# Altium schematic sheet medusa-ai-audio.SchDoc
size Legal; SheetNumber: 2; SheetTotal: 5
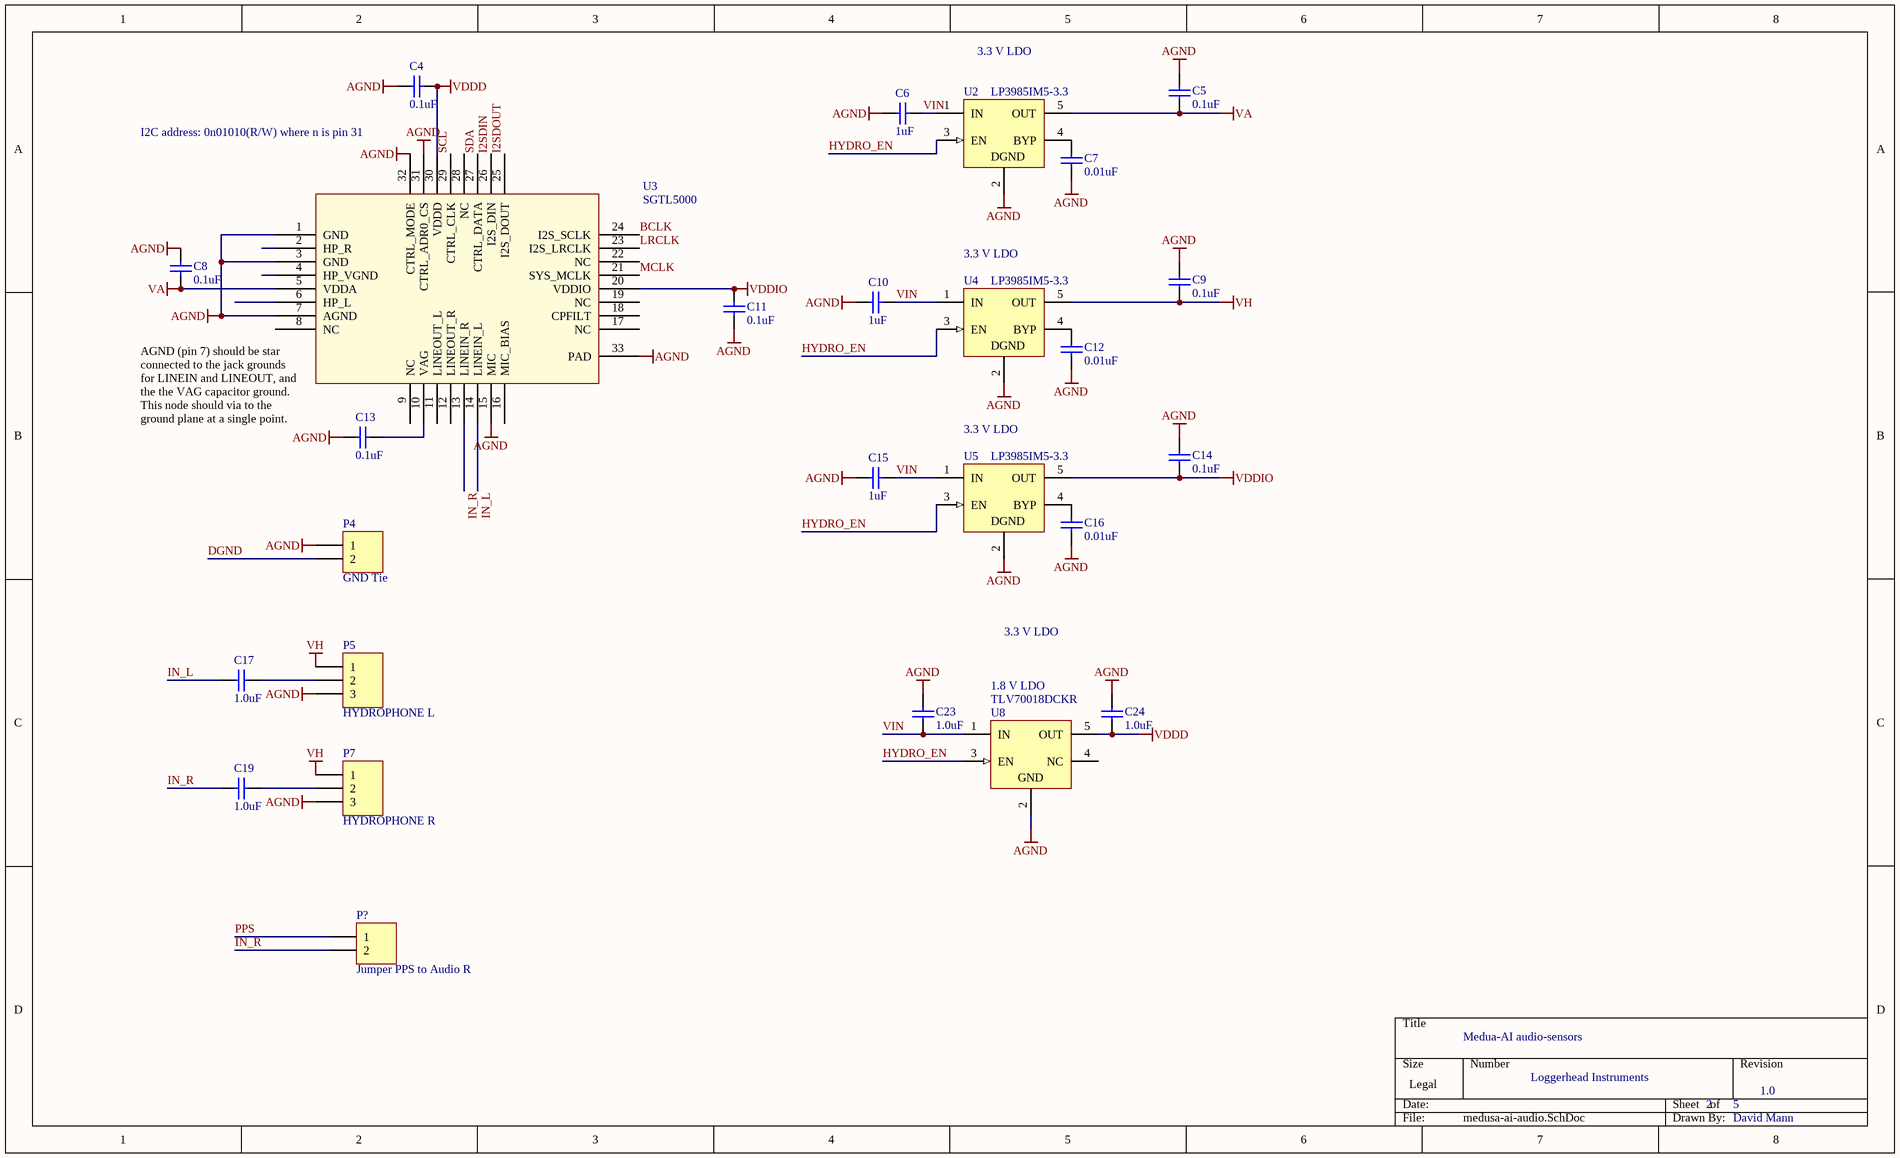
[diagram p0: medusa-ai-audio.SchDoc]

## Parts
C4  0.1uF  [0402]
C5  0.1uF  [0402]
C6  1uF  [0402]
C7  0.01uF  [0402]
C8  0.1uF  [0402]
C9  0.1uF  [0402]
C10  1uF  [0402]
C11  0.1uF  [0402]
C12  0.01uF  [0402]
C13  0.1uF  [0402]
C14  0.1uF  [0402]
C15  1uF  [0402]
C16  0.01uF  [0402]
C17  1.0uF  [0402]
C19  1.0uF  [0402]
C23  1.0uF  [0402]
C24  1.0uF  [0402]
P4  GND Tie  [HDR1X2]
P5  HYDROPHONE L  [HDR1X3]
P7  HYDROPHONE R  [HDR1X3]
P?  Jumper PPS to Audio R  [HDR1X2]
U2  LP3985IM5-3.3  [MF05A_N]
U3  SGTL5000  [QFN32]
U4  LP3985IM5-3.3  [MF05A_N]
U5  LP3985IM5-3.3  [MF05A_N]
U8  TLV70018DCKR  [TI-DCK5_V]

## Nets
AGND: C4.2 C5.2 C6.2 C7.2 C8.2 C9.2 C10.2 C11.2 C12.2 C13.2 C14.2 C15.2 C16.2 C23.2 C24.2 P4.1 P5.3 P7.3 U2.2(GND) U3.1(GND) U3.3(GND) U3.7(AGND) U3.15(MIC) U3.31(CTRL_ADR0_CS) U3.32(CTRL_MODE) U3.33(PAD) U4.2(GND) U5.2(GND) U8.2(GND)
VA: C5.1 C8.1 U2.5(OUT) U3.5(VDDA)
VDDD: C4.1 C24.1 U3.30(VDDD) U8.5(OUT)
VDDIO: C11.1 C14.1 U3.20(VDDIO) U5.5(OUT)
VH: C9.1 P5.1 P7.1 U4.5(OUT)
BCLK: U3.24(I2S_SCLK)
DGND: P4.2
HYDRO_EN: U2.3(EN) U4.3(EN) U5.3(EN) U8.3(EN)
I2SDIN: U3.26(I2S_DIN)
I2SDOUT: U3.25(I2S_DOUT)
IN_L: C17.2 U3.14(LINEIN_L)
IN_R: C19.2 P?.2 U3.13(LINEIN_R)
LRCLK: U3.23(I2S_LRCLK)
MCLK: U3.21(SYS_MCLK)
PPS: P?.1
SCL: U3.29(CTRL_CLK)
SDA: U3.27(CTRL_DATA)
VIN: C6.1 C10.1 C15.1 C23.1 U2.1(IN) U4.1(IN) U5.1(IN) U8.1(IN)
NetC7_1: C7.1 U2.4(BYP)
NetC12_1: C12.1 U4.4(BYP)
NetC13_1: C13.1 U3.10(VAG)
NetC16_1: C16.1 U5.4(BYP)
NetC17_1: C17.1 P5.2
NetC19_1: C19.1 P7.2

Not connected (* = marked no-connect by the designer): U3 2(HP_R) 4(HP_VGND) 6(HP_L) 8(NC) 9(NC) 11(LINEOUT_L) 12(LINEOUT_R) 16(MIC_BIAS) 17(NC) 18(CPFILT) 19(NC) 22(NC) 28(NC); U8 4(NC)

## Notes on the sheet
- 3.3 V LDO
- I2C address: 0n01010(R/W) where n is pin 31
- (near U4) 3.3 V LDO
- (near U3) AGND (pin 7) should be star connected to the jack grounds for LINEIN and LINEOUT, and the the VAG capacitor ground. This node should via to the ground plane at a single point.
- (near U5) 3.3 V LDO
- (near U8) 1.8 V LDO
- Medua-AI audio-sensors
- Loggerhead Instruments
- 2
- 5
- 1.0
- David Mann
- (in symbol LP3985IM5-3.3) DGND

## Library data of the parts
C4 C5 C8 C9 C11 C13 C14 = C0402: Ceramic Chip Capacitor - Standard; Note: Footprint corresponds to dimensions for bulk cassette packaging. This case size has tightened tolerances.; Published: 17-Jul-2002; LatestRevisionDate: 19-Mar-2004; LatestRevisionNote: Silkscreen size reduced.; DatasheetDocument: Mar-2001; PackageDocument: Mar-2001; PackageReference: 0402; Publisher: Altium Limited; Code_JEITA: 0402; Code_IPC: 1005 [0402]; ComponentLink1Description: Manufacturer Link; ComponentLink1URL: http://www.kemet.com/; ComponentLink2Description: Datasheet; ComponentLink2URL: http://www.kemet.com/kemet/web/homepage/kechome.nsf/vapubfilesname/F3102TA.pdf/$file/F3102TA.pdf; Value: 0.1uF
C6 C7 C10 C12 C15-C17 C19 C23 C24 = C0402: Ceramic Chip Capacitor - Standard; Note: Footprint corresponds to dimensions for bulk cassette packaging. This case size has tightened tolerances.; Value: 0.1uF; Published: 17-Jul-2002; LatestRevisionDate: 19-Mar-2004; LatestRevisionNote: Silkscreen size reduced.; DatasheetDocument: Mar-2001; PackageDocument: Mar-2001; PackageReference: 0402; Publisher: Altium Limited; Code_JEITA: 0402; Code_IPC: 1005 [0402]; ComponentLink1Description: Manufacturer Link; ComponentLink1URL: http://www.kemet.com/; ComponentLink2Description: Datasheet; ComponentLink2URL: http://www.kemet.com/kemet/web/homepage/kechome.nsf/vapubfilesname/F3102TA.pdf/$file/F3102TA.pdf
P4 P? = Header 2: Header, 2-Pin; LatestRevisionDate: 17-Jul-2002; LatestRevisionNote: Re-released for DXP Platform.; Publisher: Altium Limited
P5 P7 = Header 3: Header, 3-Pin; LatestRevisionDate: 17-Jul-2002; LatestRevisionNote: Re-released for DXP Platform.; Publisher: Altium Limited
U2 U4 U5 = LP3985IM5-3.3: Micropower, 150mA Low-Noise Ultra Low-Dropout CMOS Voltage Regulator; Manufacturer: National Semiconductor; CompType: LDO IC; PackageTopMarking: LDQB*XTT; PowerWise: N; Published: 4-Dec-2008; DatasheetVersion: Aug-2005; PackageVersion: revD, Aug-2008; PackageReference: MF05A; Publisher: Altium Limited; PackageDescription: Molded SOT-23, .115 x .063 x .040 in Body, 5 Lead, .0375 in Pitch; PartNumber: LP3985IM5-3.3; RoHS: O; PinCount: 5; DigiKeyPartNumber: LP3985IM5-3.3CT-ND; ComponentLink1Description: LP3985 Datasheet; ComponentLink1URL: http://www.national.com/ds/LP/LP3985.pdf; ComponentLink2Description: LP3985 Web Page; ComponentLink2URL: http://www.national.com/pf/LP/LP3985.html; ComponentLink3Description: MF05A Package Page; ComponentLink3URL: http://www.national.com/packaging/folders/mf05a.html
U8 = TLV70018DCKR: Single Output LDO, 200 mA, Fixed 1.8 V Output, 2 to 5.5 V Input, with Low IQ, 5-pin SC70 (DCK), -40 to 125 degC, Green (RoHS & no Sb/Br); Manufacturer: Texas Instruments; Accuracy(%): 2; Fixed Output Options(V): 1.8; Iout(Max)(A): 0.2; Iq(Typ)(mA): 0.03; SubFamily: Single Channel LDO; Vdo(Typ)(mV): 175; Vin(Max)(V): 5.5; DatasheetVersion: SLVSA00D; PackageVersion: 4093553-3/G; PackageReference: DCK5; PackageDescription: 5-Pin Plastic Small-Outline, Body 2 x 1.25 mm, Pitch 0.65 mm; Supplier 1: Digi-Key; Supplier Part Number 1: 296-32409-2-ND; Supplier 2: Digi-Key; Supplier Part Number 2: 296-32409-1-ND; Supplier 3: Digi-Key; Supplier Part Number 3: 296-32409-6-ND; Supplier 4: Newark; Supplier Part Number 4: 55R7461; Supplier 5: Mouser; Supplier Part Number 5: 595-TLV70018DCKR; Eco-Plan: Green (RoHS & no Sb/Br); Vin(Min)(V): 2; Vout Adj(Max)(V): 1.8; Vout Adj(Min)(V): 1.8; Mounting Technology: Surface Mount; Code_JEDEC: MO-203; PartNumber: TLV70018DCKR; ComponentLink1Description: Manufacturer URL; ComponentLink1URL: http://www.ti.com/; ComponentLink2Description: Datasheet; ComponentLink2URL: http://www.ti.com/general/docs/lit/getliterature.tsp?genericPartNumber=TLV70018&fileType=pdf; ComponentLink3Description: Package Specification; ComponentLink3URL: http://www.ti.com/litv/pdf/mpds025f